# EasyEDA schematic 1-Schematic_Computador de Mesa Inteligente.json
TITLE: Smart Desktop Computer; REV: 1.0; Date: 2022-06-01; Sheet: 1/1; Drawn By: Claudio Paiva; Company: Soluções de Garagem
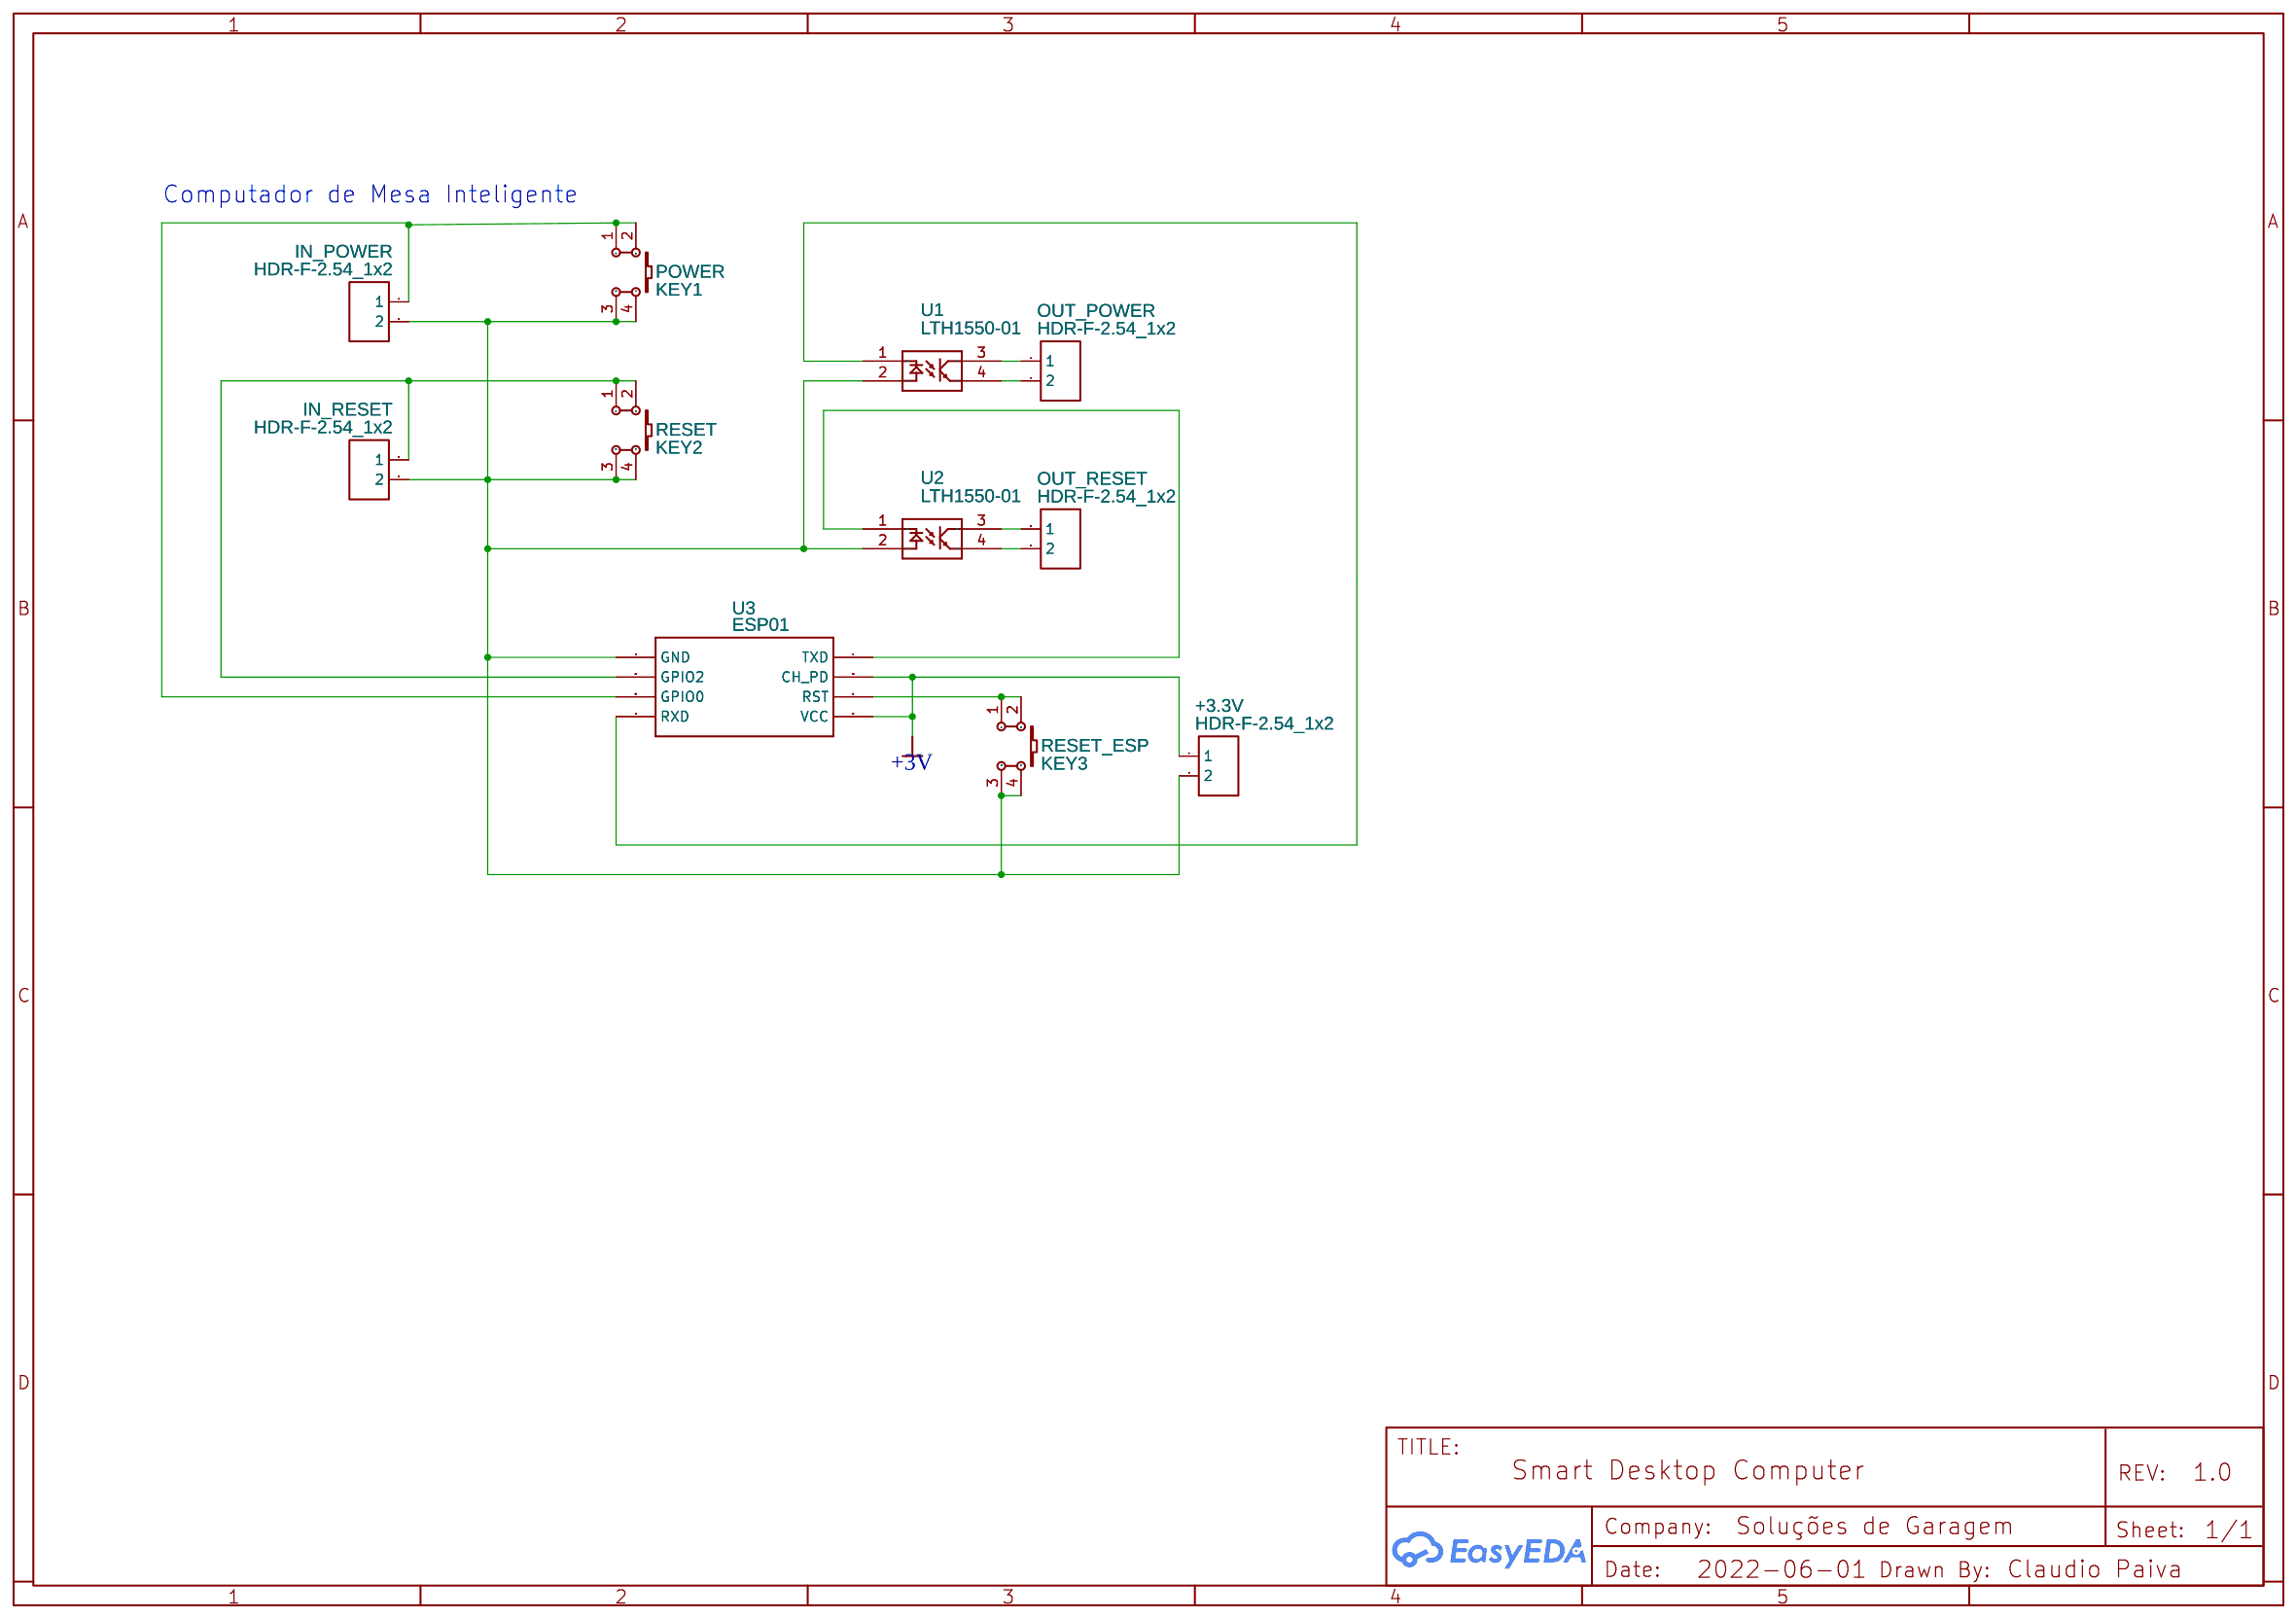
[diagram p0: schematic sheet]

## Parts
+3.3V  HDR-F-2.54_1x2  [HDR-F-2.54_1X2]
IN_POWER  HDR-F-2.54_1x2  [HDR-F-2.54_1X2]
IN_RESET  HDR-F-2.54_1x2  [HDR-F-2.54_1X2]
OUT_POWER  HDR-F-2.54_1x2  [HDR-F-2.54_1X2]
OUT_RESET  HDR-F-2.54_1x2  [HDR-F-2.54_1X2]
POWER  KEY1  [KEY-TH_4P-L6.0-W6.0-P4.50-LS6.5]
RESET  KEY2  [KEY-TH_4P-L6.0-W6.0-P4.50-LS6.5]
RESET_ESP  KEY3  [KEY-TH_4P-L6.0-W6.0-P4.50-LS6.5]
U1  LTH1550-01  [SNR4-2.54-8.7X4.5X5.8MM]
U2  LTH1550-01  [SNR4-2.54-8.7X4.5X5.8MM]
U3  ESP01  [ESP01]

## Library data of the parts
+3.3V IN_POWER IN_RESET OUT_POWER OUT_RESET = HDR-F-2.54_1x2: Supplier Part: C49661; Supplier: LCSC; Contributor: LCEDA_Lib
POWER RESET RESET_ESP = K4-6×6_TH: Supplier: LCSC; Supplier Part: C136684; Manufacturer: 韩国韩荣; Manufacturer Part: K2-1102DP-E4SW-04; Contributor: LCEDA_Lib
U1 U2 = LTH1550-01: DIP Optical Sensor;
U3 = ESP01: ESP8266 Wifi module 01

## Nets
+3V: +3.3V.1 U3.CH_PD U3.VCC
Net-(+3.3V-2): +3.3V.2 IN_POWER.2 IN_RESET.2 POWER.3 POWER.4 RESET.3 RESET.4 RESET_ESP.3 RESET_ESP.4 U1.2 U2.2 U3.GND
Net-(IN_POWER-1): IN_POWER.1 POWER.1 POWER.2 U3.GPIO0
Net-(IN_RESET-1): IN_RESET.1 RESET.1 RESET.2 U3.GPIO2
Net-(OUT_POWER-1): OUT_POWER.1 U1.3
Net-(OUT_POWER-2): OUT_POWER.2 U1.4
Net-(OUT_RESET-1): OUT_RESET.1 U2.3
Net-(OUT_RESET-2): OUT_RESET.2 U2.4
Net-(RESET_ESP-1): RESET_ESP.1 RESET_ESP.2 U3.RST
Net-(U1-1): U1.1 U3.RX(RXD)
Net-(U2-1): U2.1 U3.TX(TXD)

## Notes on the sheet
- Computador de Mesa Inteligente
